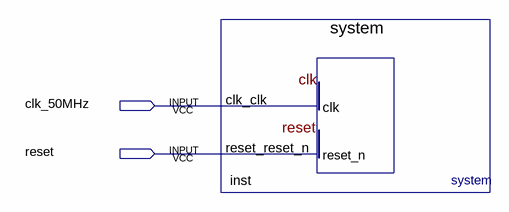
[diagram p0: schematic sheet]
// Quartus schematic mpbase.bdf as structural Verilog: 1 symbols, 2 pins
module mpbase (
  input  clk_50MHz,
  input  reset
);

  system inst (.clk_clk(clk_50MHz), .reset_reset_n(reset));
endmodule
